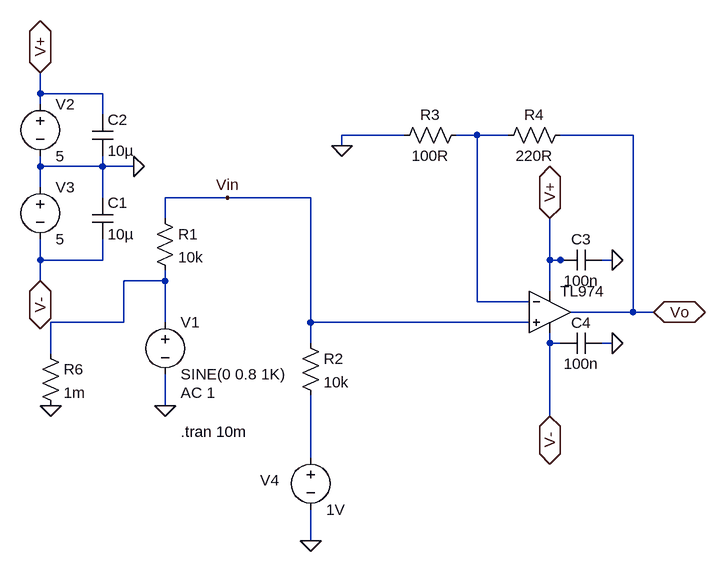
[diagram p0: schematic GuitarLineIn.asc]
GuitarLineIn.asc, the LTspice schematic file:
Version 4
SHEET 1 964 680
WIRE -128 -240 -128 -272
WIRE -32 -240 -128 -240
WIRE -128 -224 -128 -240
WIRE -32 -208 -32 -240
WIRE 432 -176 336 -176
WIRE 544 -176 512 -176
WIRE 592 -176 544 -176
WIRE 784 -176 672 -176
WIRE 336 -160 336 -176
WIRE -128 -128 -128 -144
WIRE -32 -128 -32 -144
WIRE -32 -128 -128 -128
WIRE 16 -128 -32 -128
WIRE -128 -96 -128 -128
WIRE -32 -80 -32 -128
WIRE 160 -80 64 -80
WIRE 288 -80 160 -80
WIRE 64 -48 64 -80
WIRE -128 16 -128 -16
WIRE -32 16 -32 -16
WIRE -32 16 -128 16
WIRE 656 16 656 -48
WIRE 672 16 656 16
WIRE 688 16 672 16
WIRE 752 16 736 16
WIRE -128 48 -128 16
WIRE 64 48 64 32
WIRE 64 48 0 48
WIRE 656 64 656 16
WIRE 544 80 544 -176
WIRE 624 80 544 80
WIRE 784 96 784 -176
WIRE 784 96 688 96
WIRE 816 96 784 96
WIRE 0 112 0 48
WIRE 0 112 -112 112
WIRE 64 112 64 48
WIRE 288 112 288 -80
WIRE 624 112 288 112
WIRE 288 144 288 112
WIRE 656 144 656 128
WIRE 672 144 656 144
WIRE 752 144 736 144
WIRE -112 160 -112 112
WIRE 64 240 64 192
WIRE 656 256 656 144
WIRE 288 320 288 224
WIRE 288 448 288 400
FLAG 64 240 0
FLAG 16 -128 0
FLAG -128 48 V-
IOPIN -128 48 BiDir
FLAG -128 -272 V+
IOPIN -128 -272 BiDir
FLAG 656 -48 V+
IOPIN 656 -48 BiDir
FLAG 656 256 V-
IOPIN 656 256 BiDir
FLAG 816 96 Vo
IOPIN 816 96 BiDir
FLAG 336 -160 0
FLAG 752 16 0
FLAG 752 144 0
FLAG 160 -80 Vin
FLAG -112 240 0
FLAG 288 448 0
SYMBOL OpAmps\\UniversalOpamp2 656 96 R0
SYMATTR InstName TL974
SYMBOL voltage 64 96 R0
WINDOW 123 24 124 Left 2
WINDOW 39 0 0 Left 0
SYMATTR Value2 AC 1
SYMATTR InstName V1
SYMATTR Value SINE(0 0.8 1K)
SYMBOL voltage -128 -240 R0
WINDOW 123 0 0 Left 0
WINDOW 39 0 0 Left 0
SYMATTR InstName V2
SYMATTR Value 5
SYMBOL voltage -128 -112 R0
WINDOW 123 0 0 Left 0
WINDOW 39 0 0 Left 0
SYMATTR InstName V3
SYMATTR Value 5
SYMBOL cap -48 -208 R0
SYMATTR InstName C2
SYMATTR Value 10µ
SYMBOL res 528 -192 R90
WINDOW 0 0 56 VBottom 2
WINDOW 3 32 56 VTop 2
SYMATTR InstName R3
SYMATTR Value 100R
SYMBOL res 688 -192 R90
WINDOW 0 0 56 VBottom 2
WINDOW 3 32 56 VTop 2
SYMATTR InstName R4
SYMATTR Value 220R
SYMBOL cap 736 0 R90
WINDOW 0 0 32 VBottom 2
WINDOW 3 32 32 VTop 2
SYMATTR InstName C3
SYMATTR Value 100n
SYMBOL cap 736 128 R90
WINDOW 0 0 32 VBottom 2
WINDOW 3 32 32 VTop 2
SYMATTR InstName C4
SYMATTR Value 100n
SYMBOL cap -48 -80 R0
SYMATTR InstName C1
SYMATTR Value 10µ
SYMBOL res -128 144 R0
SYMATTR InstName R6
SYMATTR Value 1m
SYMBOL res 48 -64 R0
SYMATTR InstName R1
SYMATTR Value 10k
SYMBOL res 272 128 R0
SYMATTR InstName R2
SYMATTR Value 10k
SYMBOL voltage 288 304 R0
WINDOW 0 -78 51 Left 2
WINDOW 123 0 0 Left 0
WINDOW 39 0 0 Left 0
SYMATTR InstName V4
SYMATTR Value 1V
TEXT 88 280 Left 2 !.tran 10m

The netlist it stands for:
* GuitarLineIn.asc
XTL974 Vin N001 V+ V- Vo level.2 Avol=1Meg GBW=10Meg Slew=10Meg ilimit=25m rail=0 Vos=0 phimargin=45 en=0 enk=0 in=0 ink=0 Rin=500Meg  ; pins IN+ IN- V+ V- OUT
V1 N002 0 SINE(0 0.8 1K) AC 1
V2 V+ 0 5
V3 0 V- 5
C2 V+ 0 10µ
R3 N001 0 100R
R4 Vo N001 220R
C3 0 V+ 100n
C4 0 V- 100n
C1 0 V- 10µ
R6 N002 0 1m
R1 Vin N002 10k
R2 Vin N003 10k
V4 N003 0 1V
.tran 10m
.lib UniversalOpamps2.sub
.backanno
.end